# EAGLE design placa 3 cm (EAGLE 8.0.1)
COMPANY: Unexpected Maker; DATE: 24-10-2018; DRAWN: Seon; REV: V1; TITLE: TinyPICO

## Sheet 1 of 2
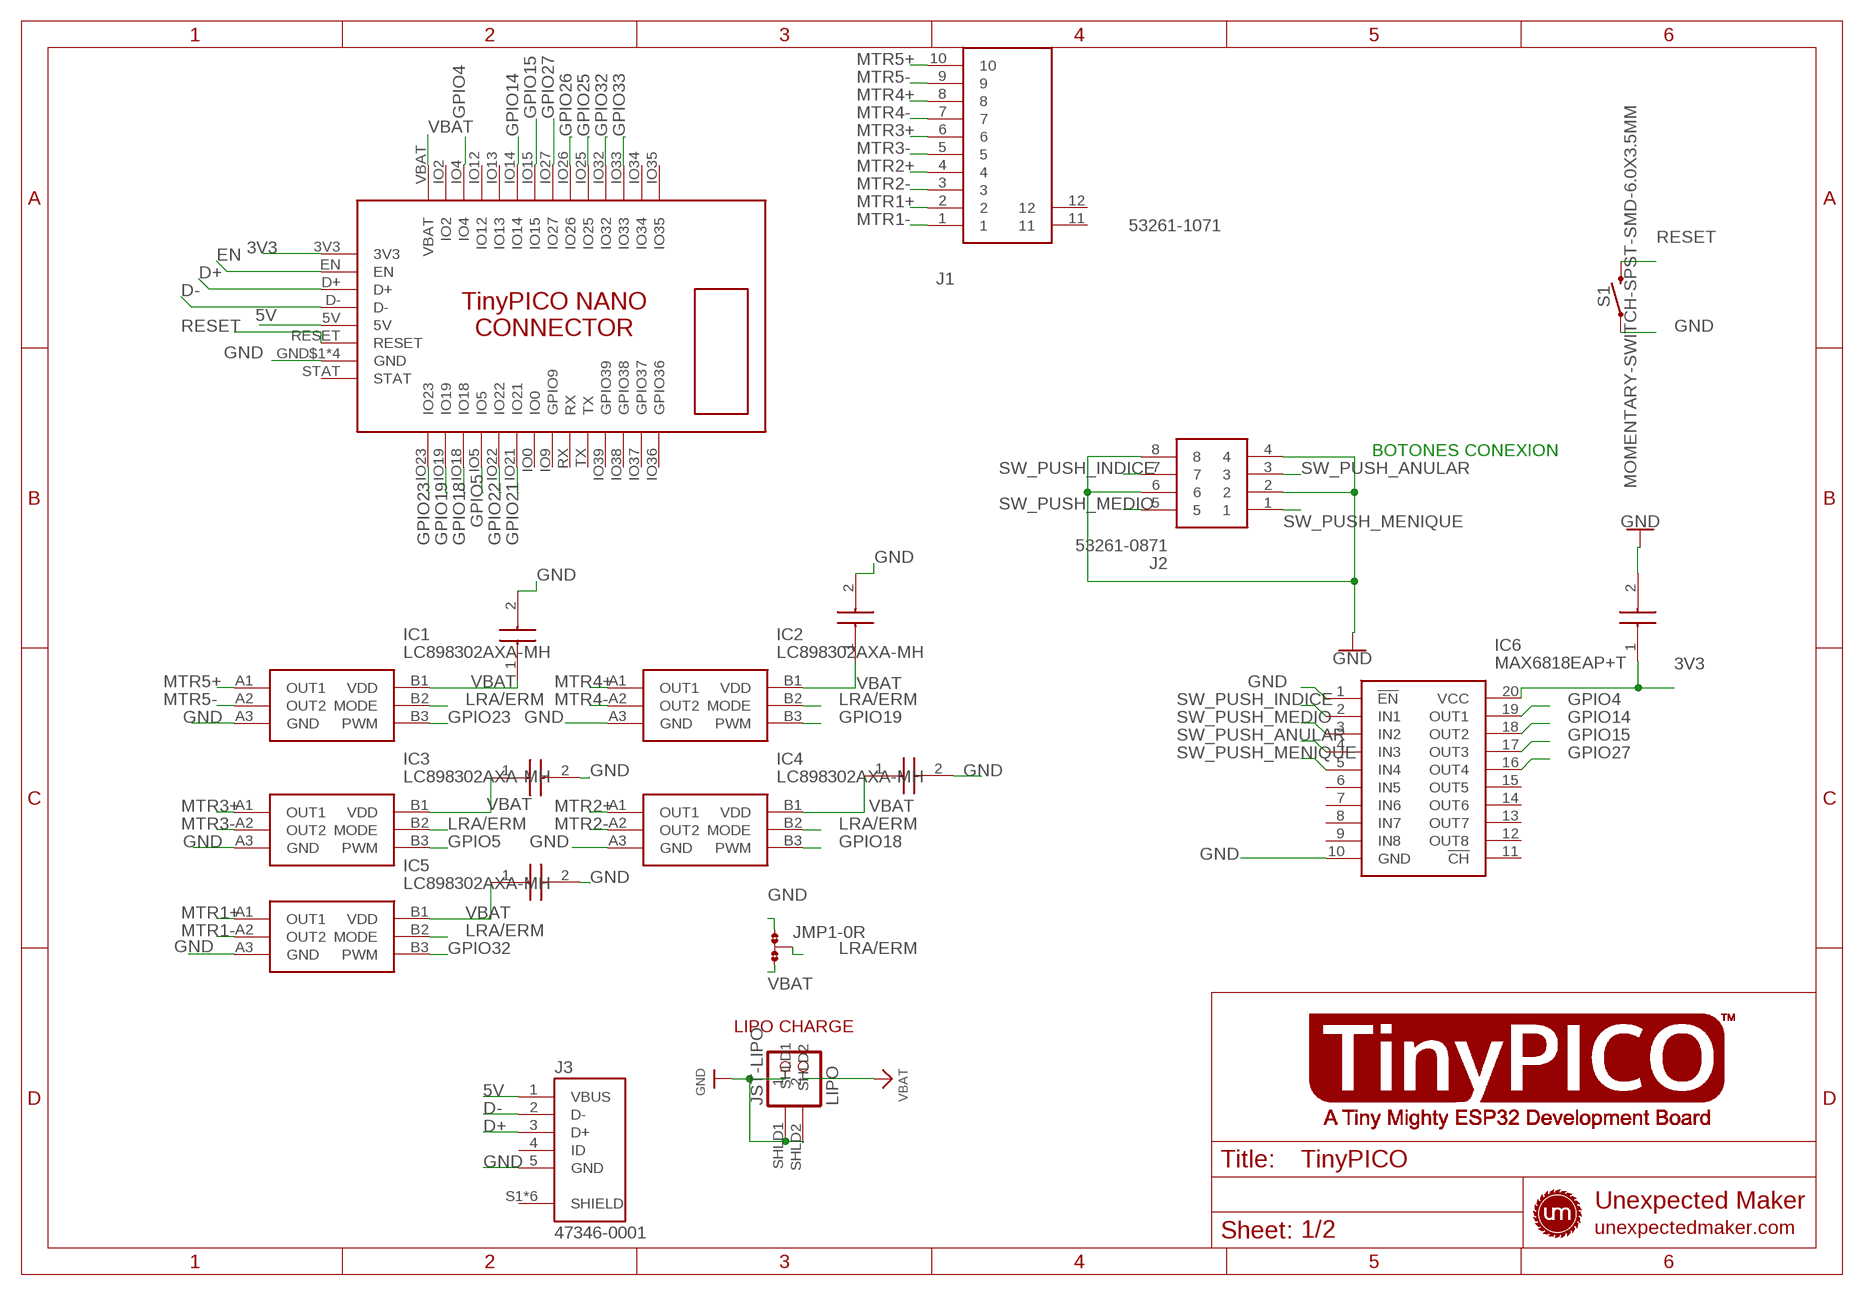
[diagram p0: schematic, sheet 1]

### Parts
C1  0603B104K160CT  [CAPC1608X87N]
C2  0603B104K160CT  [CAPC1608X87N]
C3  0603B104K160CT  [CAPC1608X87N]
C4  0603B104K160CT  [CAPC1608X87N]
C5  0603B104K160CT  [CAPC1608X87N]
C8  0603B104K160CT  [CAPC1608X87N]
IC1  LC898302AXA-MH  [BGA6C40P3X2_118X78X65]
IC2  LC898302AXA-MH  [BGA6C40P3X2_118X78X65]
IC3  LC898302AXA-MH  [BGA6C40P3X2_118X78X65]
IC4  LC898302AXA-MH  [BGA6C40P3X2_118X78X65]
IC5  LC898302AXA-MH  [BGA6C40P3X2_118X78X65]
IC6  MAX6818EAP+T  [SOP65P778X199-20N]
J1  53261-1071  [532611071]
J2  53261-0871  [53261-0871]
J3  47346-0001  [MOLEX_47346-0001]
JMP1  0R-JUMPA  [A0R-JMP]
JST-LIPO  LIPO  JST_2PIN  [JSTPH2]
S1  MOMENTARY-SWITCH-SPST-SMD-6.0X3.5MM  [TACTILE_SWITCH_SMD_6.0X3.5MM]
U$1  TINYPICO-NANO-CONNECTOR  [TINYPICO-NANO-CONNECTOR]

### Nets
3V3: C8.1 IC6.20(VCC) U$1.3V3
5V: J3.1(VBUS) U$1.5V
D+: J3.3(D+) U$1.D+
D-: J3.2(D-) U$1.D-
EN: U$1.EN
GND: C1.2 C2.2 C3.2 C4.2 C5.2 C8.2 IC1.A3(GND) IC2.A3(GND) IC3.A3(GND) IC4.A3(GND) IC5.A3(GND) IC6.1(!EN) IC6.10(GND) J2.2 J2.4 J2.6 J2.8 J3.5(GND) JMP1.1 JST-LIPO.1 JST-LIPO.SHLD1 JST-LIPO.SHLD2 S1.1 U$1.GND$1(GND) U$1.GND$2(GND) U$1.GND$3(GND) U$1.GND$4(GND)
GPIO4: IC6.19(OUT1) U$1.IO4
GPIO5: IC3.B3(PWM) U$1.IO5
GPIO14: IC6.18(OUT2) U$1.IO14
GPIO15: IC6.17(OUT3) U$1.IO15
GPIO18: IC4.B3(PWM) U$1.IO18
GPIO19: IC2.B3(PWM) U$1.IO19
GPIO21: U$1.IO21
GPIO22: U$1.IO22
GPIO23: IC1.B3(PWM) U$1.IO23
GPIO25: U$1.IO25
GPIO26: U$1.IO26
GPIO27: IC6.16(OUT4) U$1.IO27
GPIO32: IC5.B3(PWM) U$1.IO32
GPIO33: U$1.IO33
LRA/ERM: IC1.B2(MODE) IC2.B2(MODE) IC3.B2(MODE) IC4.B2(MODE) IC5.B2(MODE) JMP1.2
MTR1+: IC5.A1(OUT1) J1.2
MTR1-: IC5.A2(OUT2) J1.1
MTR2+: IC4.A1(OUT1) J1.4
MTR2-: IC4.A2(OUT2) J1.3
MTR3+: IC3.A1(OUT1) J1.6
MTR3-: IC3.A2(OUT2) J1.5
MTR4+: IC2.A1(OUT1) J1.8
MTR4-: IC2.A2(OUT2) J1.7
MTR5+: IC1.A1(OUT1) J1.10
MTR5-: IC1.A2(OUT2) J1.9
RESET: S1.2 U$1.RESET
SW_PUSH_ANULAR: IC6.4(IN3) J2.3
SW_PUSH_INDICE: IC6.2(IN1) J2.7
SW_PUSH_MEDIO: IC6.3(IN2) J2.5
SW_PUSH_MENIQUE: IC6.5(IN4) J2.1
VBAT: C1.1 C2.1 C3.1 C4.1 C5.1 IC1.B1(VDD) IC2.B1(VDD) IC3.B1(VDD) IC4.B1(VDD) IC5.B1(VDD) JMP1.3 JST-LIPO.2 U$1.VBAT
Unconnected: IC6.6(IN5) IC6.7(IN6) IC6.8(IN7) IC6.9(IN8) IC6.11(!CH) IC6.12(OUT8) IC6.13(OUT7) IC6.14(OUT6) IC6.15(OUT5) J1.11 J1.12 J3.4(ID) J3.S1(SHIELD) J3.S2(SHIELD) J3.S3(SHIELD) J3.S4(SHIELD) J3.S5(SHIELD) J3.S6(SHIELD) U$1.IO0 U$1.IO2 U$1.IO9(GPIO9) U$1.IO12 U$1.IO13 U$1.IO34 U$1.IO35 U$1.IO36(GPIO36) U$1.IO37(GPIO37) U$1.IO38(GPIO38) U$1.IO39(GPIO39) U$1.RX U$1.STAT U$1.TX

### Notes on the sheet
- BOTONES CONEXION
- LIPO CHARGE

## Sheet 2 of 2: Botons
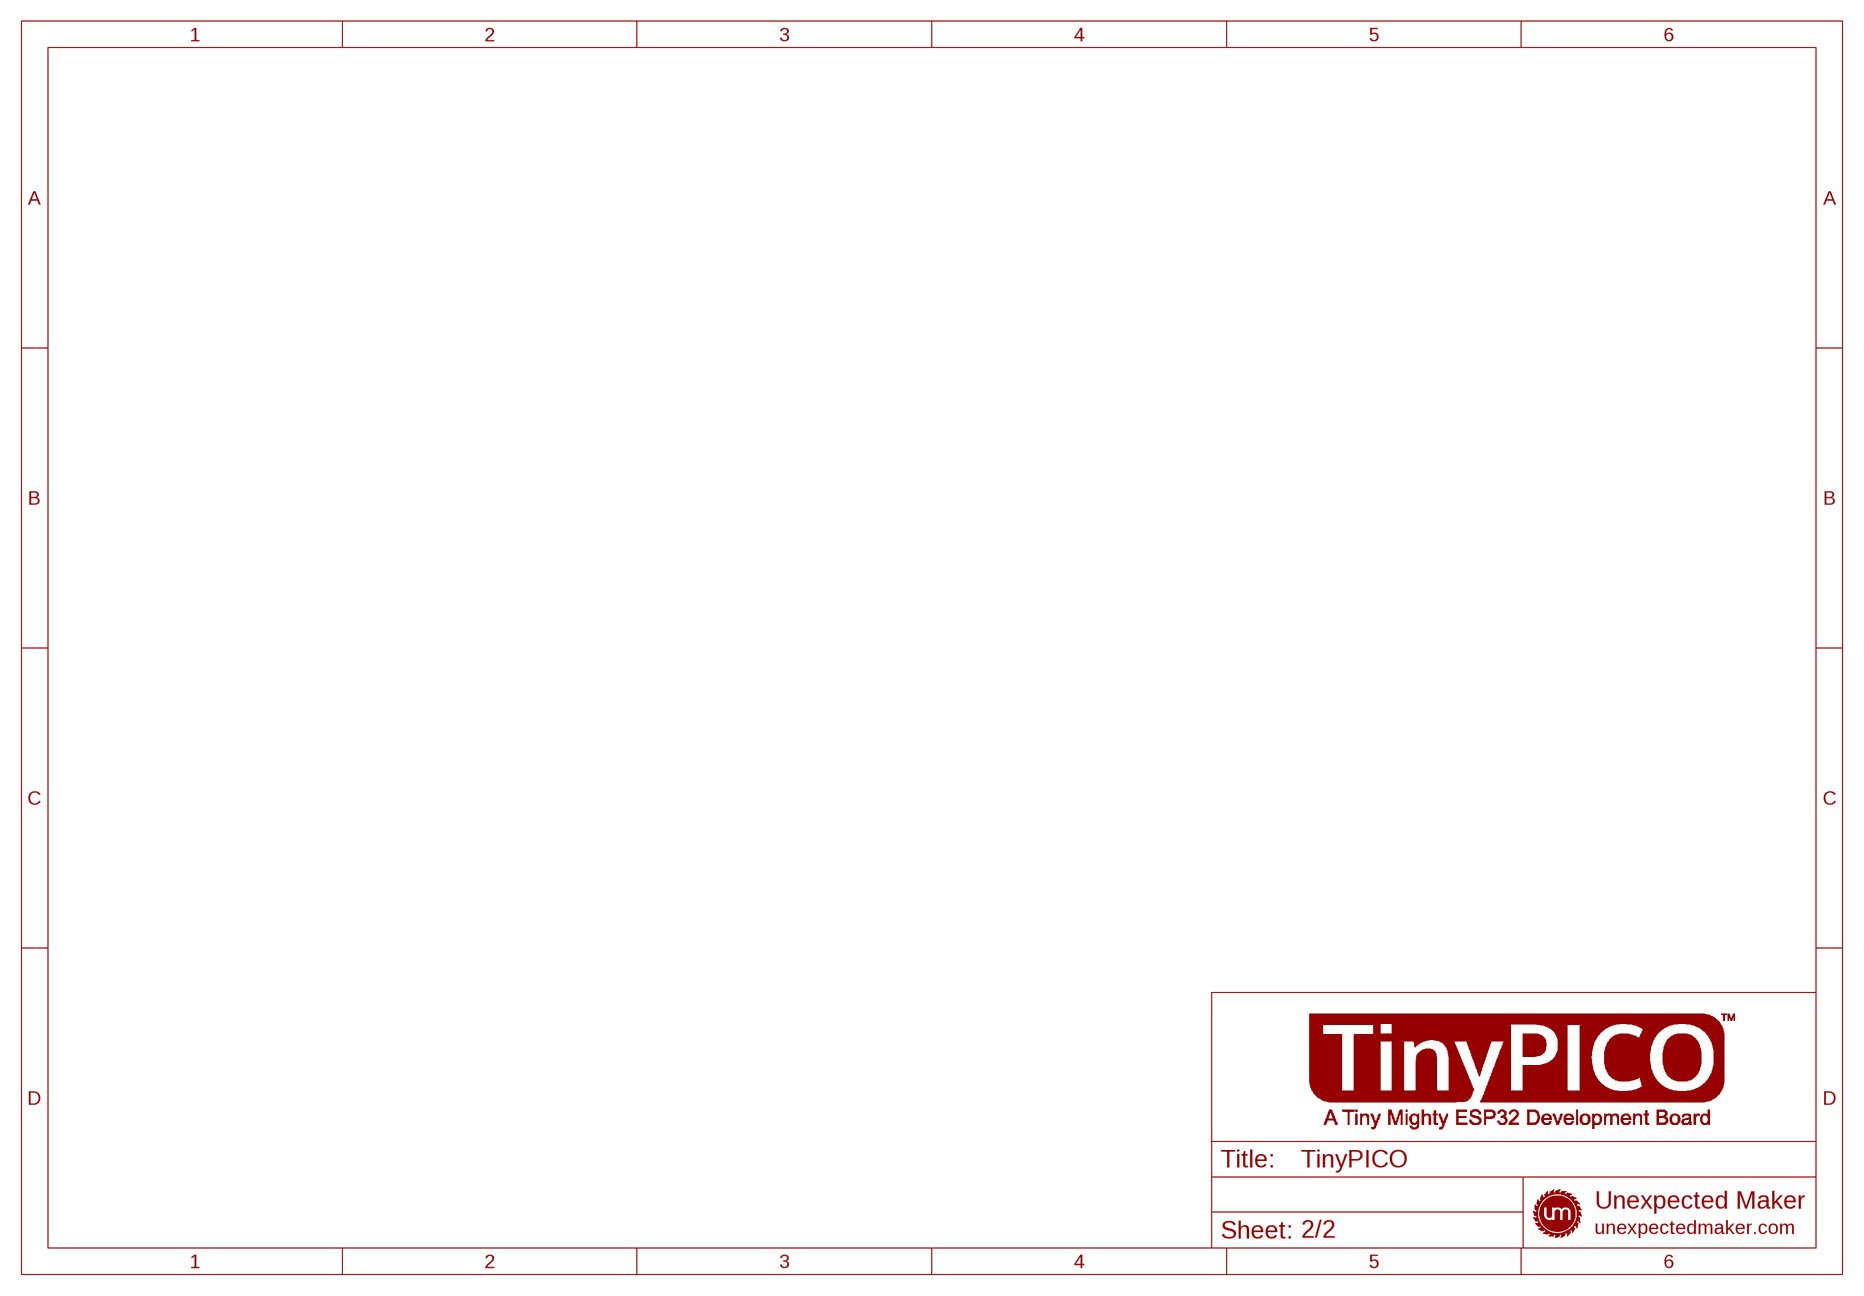
[diagram p1: schematic, sheet 2]

## Library data of the parts
C1-C5 C8 = SamacSys_Parts:0603B104K160CT: WALSIN - 0603B104K160CT - CAP, 0.1F, 16V, 10%, X7R, 0603 Source: Datasheet <https://componentsearchengine.com/Datasheets/1/0603B104K160CT.pdf>; DESCRIPTION: WALSIN - 0603B104K160CT - CAP, 0.1F, 16V, 10%, X7R, 0603; HEIGHT: 0.87mm; MANUFACTURER_NAME: Walsin Technology Corporation; MANUFACTURER_PART_NUMBER: 0603B104K160CT; MOUSER_PART_NUMBER: 791-0603B104K160CT; MOUSER_PRICE-STOCK: https://www.mouser.com/Search/Refine.aspx?Keyword=791-0603B104K160CT
IC1-IC5 = SamacSys_Parts:LC898302AXA-MH: Motor / Motion / Ignition Controllers & Drivers Linear Vibrator Driv Source: Datasheet <https://www.arrow.com/en/products/lc898302axa-mh/on-semiconductor>; DESCRIPTION: Motor / Motion / Ignition Controllers & Drivers Linear Vibrator Driv; HEIGHT: 0.65mm; MANUFACTURER_NAME: ON Semiconductor; MANUFACTURER_PART_NUMBER: LC898302AXA-MH; MOUSER_PART_NUMBER: 863-LC898302AXA-MH; MOUSER_PRICE-STOCK: https://www.mouser.co.uk/ProductDetail/ON-Semiconductor/LC898302AXA-MH?qs=raqtESnDWsCbGq19hBfPlw%3D%3D
IC6 = SamacSys_Parts:MAX6818EAP+T: MAXIM INTEGRATED PRODUCTS - MAX6818EAP+T. - ESD PROTE WITH SWITCH DEBOUNCER, SSOP-20 Source: Datasheet; DESCRIPTION: MAXIM INTEGRATED PRODUCTS - MAX6818EAP+T. - ESD PROTE WITH SWITCH DEBOUNCER, SSOP-20; HEIGHT: 1.99mm; MANUFACTURER_NAME: Maxim Integrated; MANUFACTURER_PART_NUMBER: MAX6818EAP+T; MOUSER_PART_NUMBER: 700-MAX6818EAPT; MOUSER_PRICE-STOCK: https://www.mouser.co.uk/ProductDetail/Maxim-Integrated/MAX6818EAP%2bT?qs=CDqwynd4ZNoKt6d34O8j%252BA%3D%3D
J1 = SamacSys_Parts:53261-1071: 10 way SMT r/a header Molex PICOBLADE Series, Series Number 53261, 1.25mm Pitch 10 Way 1 Row Shrouded Right Angle PCB Header, Surface Mount Source: Datasheet <https://www.molex.com/webdocs/datasheets/pdf/en-us/0532611071_PCB_HEADERS.pdf>; DESCRIPTION: 10 way SMT r/a header Molex PICOBLADE Series, Series Number 53261, 1.25mm Pitch 10 Way 1 Row Shrouded Right Angle PCB Header, Surface Mount; HEIGHT: 3mm; MANUFACTURER_NAME: Molex; MANUFACTURER_PART_NUMBER: 53261-1071; MOUSER_PART_NUMBER: 538-53261-1071; MOUSER_PRICE-STOCK: https://www.mouser.co.uk/ProductDetail/Molex/53261-1071?qs=%252B72YyncTwW%252Bzs3RwZTiukQ%3D%3D
J2 = SamacSys_Parts:53261-0871: Molex PICOBLADE Series, Series Number 53261, 1.25mm Pitch, 8 Way 1 Row Shrouded Right Angle PCB Header, Surface Mount Source: Datasheet <http://www.molex.com/webdocs/datasheets/pdf/en-us/0532610871_PCB_HEADERS.pdf>; DESCRIPTION: Molex PICOBLADE Series, Series Number 53261, 1.25mm Pitch, 8 Way 1 Row Shrouded Right Angle PCB Header, Surface Mount; HEIGHT: mm; MANUFACTURER_NAME: Molex; MANUFACTURER_PART_NUMBER: 53261-0871; MOUSER_PART_NUMBER: 538-53261-0871; MOUSER_PRICE-STOCK: https://www.mouser.co.uk/ProductDetail/Molex/53261-0871?qs=%252B72YyncTwW%252BggfdCJ7Netw%3D%3D
J3 = 47346-0001:47346-0001: USB Connectors MICRO USB B RECPT BTTM MOUNT ASSY Check prices <https://pricing.snapeda.com/parts/47346-0001/Molex/view-part?ref=eda>; AVAILABILITY: Warning; DESCRIPTION: USB Connectors MICRO USB B RECPT BTTM MOUNT ASSY; MF: Molex; MP: 47346-0001; PACKAGE: None; PRICE: None; PURCHASE-URL: https://pricing.snapeda.com/search/part/47346-0001/?ref=eda
JMP1 = jump-0r-smd:0R-JUMP: SMD 0R 0805 Jumper
JST-LIPO = UnexpectedMaker:JST_2PIN: JST 2-Pin Right-Angle Connector PH-Series - 4UConnector: 17311 SH-Series - 4UConnector: 07278
S1 = SparkFun-Switches:MOMENTARY-SWITCH-SPST: Momentary Switch (Pushbutton) - SPST Normally-open (NO) SPST momentary switches (buttons, pushbuttons). Variants PTH-12MM - 12mm square, through-hole Momentary Pushbutton Switch - 12mm Square <https://www.sparkfun.com/products/9190> (COM-09190) PTH-6.0MM, PTH-6.0MM-KIT - 6.0mm square, through-hole Mini Pushbutton Switch <https://www.sparkfun.com/products/97> (COM-00097) KIT package intended for soldering kit's - only one side of pads' copper is exposed. PTH-RIGHT-ANGLE-KIT - Right-angle, through-hole Right Angle Tactile Button <https://www.sparkfun.com/products/10791> - Used on SparkFun BigTime Watch Kit <https://www.sparkfun.com/products/11734> SMD-12MM - 12mm square, surface-mount Tactile Button - SMD (12mm) <https://www.sparkfun.com/products/12993> (COM-12993) Used on SparkFun PicoBoard <https://www.sparkfun.com/products/11888> SMD-4.5MM - 4.5mm Square Trackball Switch Used on SparkFun Blackberry Trackballer Breakout <https://www.sparkfun.com/products/13169> SMD-4.6MMX2.8MM - 4.60mm x 2.80mm, surface mount Used on SparkFun SAMD21 Mini Breakout <https://www.sparkfun.com/products/13664> SMD-5.2MM, SMD-5.2-REDUNDANT - 5.2mm square, surface-mount Mini Pushbutton Switch - SMD <https://www.sparkfun.com/products/8720> (COM-08720) Used on Arduino Pro Mini <https://www.sparkfun.com/products/11114> REDUNDANT package connects both switch circuits together SMD-6.0X3.5MM - 6.0 x 3.5mm, surface mount Momentary Reset Switch SMD <https://www.sparkfun.com/products/8229> (COM-08229) SMD-6.2MM-TALL - 6.2mm square, surface mount Tactile Button - SMD (6mm) <https://www.sparkfun.com/products/12992> Used on SparkFun Digital Sandbox <https://www.sparkfun.com/products/12651> SMD-RIGHT-ANGLE - Right-angle, surface mount Used on SparkFun Block for Intel® Edison - Arduino <https://www.sparkfun.com/products/13036>; PROD_ID: SWCH-00815; SF_SKU: COM-08229
U$1 = TinyPICO_NANO_Eagle:TINYPICO-NANO-CONNECTOR: TinyPICO NANO Footprint https://www.tinypico.com/tinypico-nano

## Board
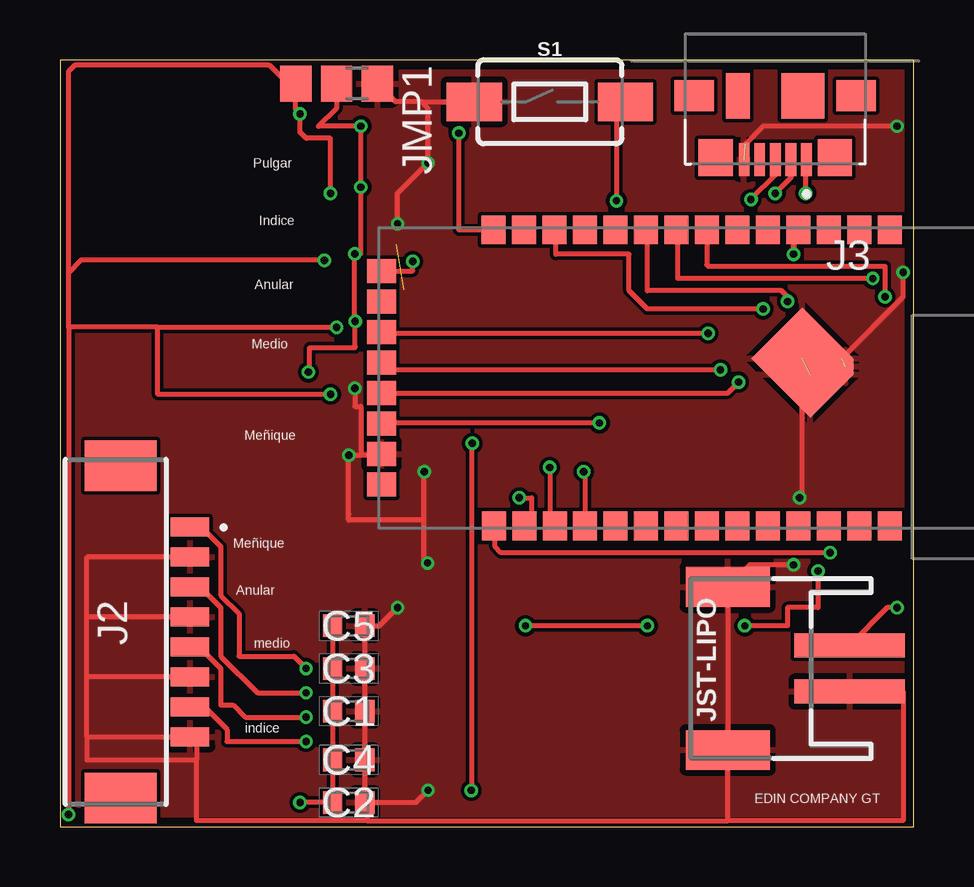
[diagram p2: board, top side]
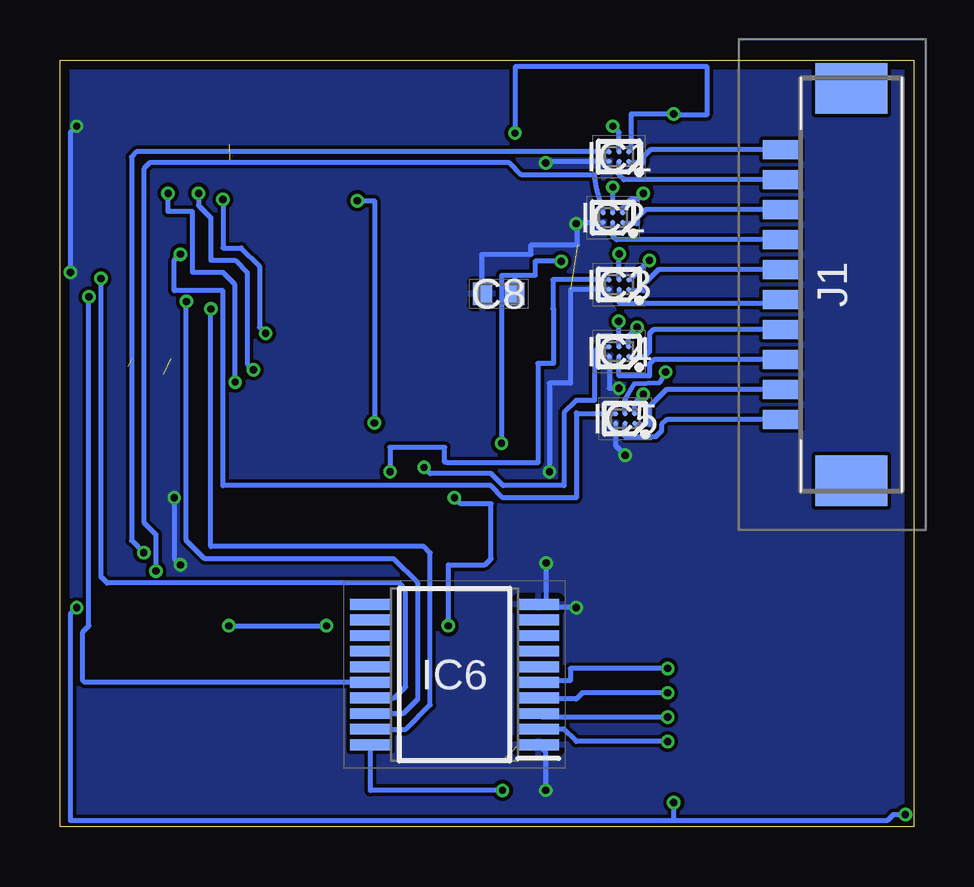
[diagram p3: board, bottom side, seen from below]

Size 35.6 x 31.97 mm. Coordinates in mm from the lower left corner, seen from the top.
Outline: 0,31.97 0,0 35.6,0 35.6,31.97 0,31.97
Copper layers (1*16): Top 0.035559375mm / dielectric 1.6mm / Bottom 0.035559375mm
Design rules "oshpark-2layer": minimum track width 6mil, minimum drill 10mil, track to track 6mil, track to pad 6mil, pad to pad 6mil, via to via 6mil, smd to smd 6mil, copper to edge 15mil, drill to drill 6mil, minimum pad ring 5mil, minimum via ring 5mil, stop-mask expansion 2.5mil, vias tented up to drill 0mil, thermal gap 10mil

### Footprints (pad centres in the part's own frame; a part is rotated, then mirrored left to right if it is on the bottom)
CAPC1608X87N = smd 0.8 x 0.94: 1 -0.67,0; 2 0.67,0
BGA6C40P3X2_118X78X65 = smd 0.2 x 0.2: A1 -0.4,0.2; A2 0,0.2; A3 0.4,0.2; B1 -0.4,-0.2; B2 0,-0.2; B3 0.4,-0.2
SOP65P778X199-20N = smd 1.705 x 0.45: 1 -3.498,2.925; 2 -3.498,2.275; 3 -3.498,1.625; 4 -3.498,0.975; 5 -3.498,0.325; 6 -3.498,-0.325; 7 -3.498,-0.975; 8 -3.498,-1.625; 9 -3.498,-2.275; 10 -3.498,-2.925; 11 3.498,-2.925; 12 3.498,-2.275; 13 3.498,-1.625; 14 3.498,-0.975; 15 3.498,-0.325; 16 3.498,0.325; 17 3.498,0.975; 18 3.498,1.625; 19 3.498,2.275; 20 3.498,2.925
532611071 = smd 0.8 x 1.6: 1 -5.625,2.1; 2 -4.375,2.1; 3 -3.125,2.1; 4 -1.875,2.1; 5 -0.625,2.1; 6 0.625,2.1; 7 1.875,2.1; 8 3.125,2.1; 9 4.375,2.1; 10 5.625,2.1 | smd 2.1 x 3: 11 -8.175,-0.8; 12 8.175,-0.8
53261-0871 = smd 0.8 x 1.6: 1 -4.375,1.004; 2 -3.125,1.004; 3 -1.875,1.004; 4 -0.625,1.004; 5 0.625,1.004; 6 1.875,1.004; 7 3.125,1.004; 8 4.375,1.004 | smd 2.1 x 3: 9 6.925,-1.896; 10 -6.925,-1.896
MOLEX_47346-0001 = smd 0.45 x 1.38: 1 -1.3,2.66; 2 -0.65,2.66; 3 0,2.66; 4 0.65,2.66; 5 1.3,2.66 | smd 1.425 x 1.55: S1 -2.487,2.575; S2 2.487,2.575 | smd 1.65 x 1.3: S3 -3.375,0; S6 3.375,0 | smd 1.8 x 1.9: S4 -1.15,0 | smd 1 x 1.9: S5 1.55,0
A0R-JMP = smd 1.5 x 1.3: 1 0,1.7; 2 0,0; 3 0,-1.7
JSTPH2 = smd 1 x 4.6: 1 -0.965,-3.607; 2 0.965,-3.607 | smd 1.651 x 3.505: SHLD1 -3.4,1.473; SHLD2 3.4,1.473
TACTILE_SWITCH_SMD_6.0X3.5MM = smd 2.3 x 1.6: 1 -3.15,0; 2 3.15,0
TINYPICO-NANO-CONNECTOR = smd 1.2 x 1: 3V3 0.1,10.725; 5V 0.1,5.645; D+ 0.1,8.185; D- 0.1,6.915; EN 0.1,9.455; GND$1 0.1,3.105; RESET 0.1,4.375; STAT 0.1,1.835 | smd 3 x 3 rotated 45: GND$2 17.643,7.082 | smd 0.66 x 0.671: GND$3 19.436,6.746 | smd 2.54 x 2.54 rotated 45: GND$4 17.971,6.413 | smd 1 x 1.2: IO0 12.395,0.1; IO2 6.034,12.44; IO4 7.304,12.44; IO5 8.585,0.1; IO9 13.665,0.1; IO12 8.574,12.44; IO13 9.844,12.44; IO14 11.114,12.44; IO15 12.384,12.44; IO18 7.315,0.1; IO19 6.045,0.1; IO21 11.125,0.1; IO22 9.855,0.1; IO23 4.775,0.1; IO25 16.194,12.44; IO26 14.924,12.44; IO27 13.654,12.44; IO32 17.464,12.44; IO33 18.734,12.44; IO34 20.004,12.44; IO35 21.274,12.44; IO36 21.285,0.1; IO37 20.015,0.1; IO38 18.745,0.1; IO39 17.475,0.1; RX 14.935,0.1; TX 16.205,0.1; VBAT 4.764,12.44

### Placement (x,y rotation side)
C1  12.04,4.82 0 top
C2  12.04,1.01 0 top
C3  12.04,6.6 0 top
C4  12.04,2.79 0 top
C5  12.04,8.38 0 top
C8  17.31,22.22 180 bottom
IC1  12.29,27.94 180 bottom
IC2  12.55,25.4 180 bottom
IC3  12.29,22.6 180 bottom
IC4  12.29,19.81 180 bottom
IC5  12.04,17.02 180 bottom
IC6  19.15,6.35 180 bottom
J1  3.4,22.6 90 bottom
J2  4.42,8.13 270 top
J3  29.82,30.48 180 top
JMP1  11.53,30.99 270 top
JST-LIPO  29.31,6.6 90 top
S1  20.42,30.22 0 top
U$1  13.31,12.44 0 top

### Tracks (layer width: path | path; a pad name or v marks a point on that pad's centre or on a via)
3V3  (via drill 0.3)
  Top 0.203: U$1.3V3 14.71,23.17 v14.71,23.58 | v17.19,15.98 17.15,15.98 v17.15,1.52
  Bottom 0.203: v14.71,23.58 15.78,23.58 15.78,23.53 15.79,23.53 15.79,22.98 16.65,22.98 | 16.65,22.98 C8.1 | 16.65,22.98 17.19,22.98 v17.19,15.98 | IC6.20 22.65,1.52 v17.15,1.52
5V  (via drill 0.3)
  Top 0.203: U$1.5V 27.84,18.09 v28.3,18.54 | v31.09,26.41 31.09,27.79 J3.1
  Bottom 0.203: v28.3,18.54 28.3,22.6 28.8,23.11 30.07,23.11 30.07,25.65 31.09,25.65 v31.09,26.41
D+  (via drill 0.3)
  Top 0.203: J3.3 29.82,27.18 v28.8,26.16 | v27.03,20.57 13.47,20.57 U$1.D+
  Bottom 0.203: v28.8,26.16 28.8,24.13 28.04,24.13 27.28,23.37 27.28,20.83 v27.03,20.57
D-  (via drill 0.3)
  Top 0.203: J3.2 30.47,27.06 v29.82,26.41 | v27.53,19.05 13.72,19.05 U$1.D-
  Bottom 0.203: v29.82,26.41 29.82,25.91 29.31,25.4 29.31,23.62 28.3,23.62 27.79,23.11 27.79,19.3 v27.53,19.05
GND  (via drill 0.3)  (4 unrouted)
  Top 0.203: J2.2 1.12,11.25 1.12,8.75 | 5.69,2.79 1.12,2.79 1.12,3.75 | 1.12,6.25 1.12,8.75 | 1.12,3.75 1.12,6.25 | J2.4 1.12,8.75 | J2.6 1.12,6.25 | 1.12,3.75 J2.8 5.69,3.75 5.69,2.79 | C2.2 12.8,1.01 12.8,0.25 | 12.8,0.25 5.69,0.25 5.69,2.79 | C2.2 C4.2 C1.2 C3.2 C5.2 13.31,8.38 v14.07,9.14 | 27.84,0.25 JST-LIPO.SHLD1 JST-LIPO.SHLD2 28.76,10.92 v30.58,10.92 | 12.8,0.25 27.84,0.25 | JST-LIPO.1 35.15,5.64 35.15,0.25 27.84,0.25 | C2.2 14.83,1.01 v15.34,1.52 | v30.84,13.71 30.95,13.83 U$1.GND$2 32.58,19.53 35.15,22.1 v35.15,23.11 | v34.9,29.21 29.31,29.21 28.55,28.45 | 15.09,30.22 S1.1 | 15.09,30.22 13.99,30.22 JMP1.1 | 15.09,30.22 15.34,29.97 v15.34,27.68 14.07,26.41 v14.07,25.14 | 12.55,15.49 v12.04,15.49 12.04,13.02 12.04,12.79 15.17,12.79 | 12.55,15.49 13.35,15.49 U$1.GND$1 | v12.29,18.29 12.29,17.52 12.55,17.52 12.55,15.49 | v15.19,14.8 15.17,14.8 15.17,12.79 | v15.32,11 15.17,11 15.17,12.79
  Bottom 0.203: v15.34,1.52 15.34,3.11 IC6.1 | v30.84,13.71 30.84,11.17 v30.58,10.92 | v35.15,23.11 35.15,28.95 v34.9,29.21 | v14.07,9.14 15.52,9.14 IC6.10 15.32,9.27 v15.32,11 | IC1.A3 15.29,27.74 v15.34,27.68 | 14.02,25.2 IC2.A3 | 14.02,25.2 v14.07,25.14 | IC5.A3 12.44,15.89 v12.04,15.49 | IC4.A3 12.69,18.29 v12.29,18.29 | IC3.A3 14.32,22.4 14.32,18.5 15.19,18.5 v15.19,14.8 | C8.2 18.01,23.08 18.01,23.87 15.96,23.87 15.96,24.26 14.02,24.26 14.02,25.2
  pour Bottom: 35.53,33.35 35.53,-3.7 -1.02,-3.68 -1.02,33.37
  pour Top: -1.17,33.53 -1.17,-4.57 35.57,-4.76 35.57,33.34
GPIO4  (via drill 0.3)
  Top 0.203: v29.31,21.59 24.49,21.59 23.72,22.35 23.72,23.87 20.68,23.87 20.68,24.82 U$1.IO4
  Bottom 0.203: IC6.19 21.17,4.07 20.17,5.08 20.17,11.43 20.42,11.68 29.31,11.68 v29.31,21.59
GPIO5  (via drill 0.3)
  Top 0.203: v21.84,14.81 21.89,14.81 U$1.IO5
  Bottom 0.203: IC3.B3 15.05,22.8 15.05,21.59 15.02,21.59 15.02,19.32 15.67,19.32 15.67,15.17 19.45,15.17 19.45,15.2 19.57,15.2 19.57,15.82 21.84,15.82 v21.84,14.81
GPIO14  (via drill 0.3)
  Top 0.203: v30.33,21.9 30.33,22.1 30.07,22.35 24.49,22.35 24.49,24.82 U$1.IO14
  Bottom 0.203: IC6.18 21.29,4.72 20.68,5.33 20.68,10.16 21.69,11.17 29.57,11.17 30.33,11.94 v30.33,21.9
GPIO15  (via drill 0.3)
  Top 0.203: v33.88,22.86 25.76,22.86 25.76,24.82 U$1.IO15
  Bottom 0.203: IC6.17 21.65,5.37 21.18,5.84 21.18,9.9 21.44,10.16 33.63,10.16 33.88,10.41 v33.88,22.86
GPIO18  (via drill 0.3)
  Top 0.203: v20.42,14.98 20.42,12.75 U$1.IO18
  Bottom 0.203: IC4.B3 13.11,20.01 13.31,19.81 13.31,17.78 14.07,17.78 14.58,17.27 14.58,14.22 17.12,14.22 17.63,14.73 20.17,14.73 v20.42,14.98
GPIO19  (via drill 0.3)
  Top 0.203: v31.6,10.67 31.6,9.14 30.33,9.14 30.33,8.38 v28.55,8.38 | v24.49,8.38 v19.41,8.38 | v19.15,13.71 19.66,13.71 19.66,12.85 U$1.IO19
  Bottom 0.203: IC2.B3 13.2,26.56 13.31,27.18 16.36,27.18 16.87,27.68 31.85,27.68 32.11,27.43 32.11,12.7 31.6,12.19 v31.6,10.67 | v28.55,8.38 v24.49,8.38 | v19.41,8.38 19.41,10.92 17.88,10.92 17.63,11.17 17.63,13.46 18.9,13.46 v19.15,13.71
GPIO23  (via drill 0.3)
  Top 0.203: v32.11,11.43 18.39,11.43 18.14,11.68 18.14,12.49 U$1.IO23
  Bottom 0.203: IC1.B3 32.41,28.14 32.61,27.94 32.61,11.94 v32.11,11.43
GPIO27  (via drill 0.3)
  Top 0.203: U$1.IO27 26.96,23.43 27.03,23.37 34.39,23.37 v34.39,22.1
  Bottom 0.203: IC6.16 34.58,6.02 34.65,6.09 34.65,8.13 34.39,8.38 v34.39,22.1
GPIO32  (via drill 0.3)
  Top 0.254: U$1.IO32 30.58,24.88 v30.58,23.87
  Bottom 0.203: IC5.B3 14.02,17.22 14.07,17.27 14.07,13.71 17.12,13.71 17.63,14.22 28.8,14.22 28.8,22.35 30.84,22.35 30.84,23.62 v30.58,23.87
LRA/ERM  (via drill 0.3)
  Top 0.203: JMP1.2 11.53,29.97 10.77,29.21 v12.55,29.21 v12.55,26.67 12.55,23.88 v12.29,23.88 12.29,21.08 v12.3,21.08 IC4.B2 12.29,19.97 10.41,19.97 10.41,18.96 v10.35,18.96
  Bottom 0.203: IC1.B2 12.29,28.95 v12.55,29.21 | IC2.B2 v12.55,26.67 | IC5.B2 12.04,17.82 | 12.04,17.82 12.02,17.82 | 12.04,17.82 11.66,18.48 10.6,18.52 v10.35,18.96 | IC3.B2 v12.29,23.88 | IC4.B2 v12.3,21.08
MTR1+
  Bottom 0.203: J1.2 10.32,18.23 11.02,17.52 11.02,16.76 11.59,16.76 IC5.A1
MTR1-
  Bottom 0.203: J1.1 10.3,16.98 10.52,16.76 10.52,16.51 10.77,16.25 12.04,16.25 IC5.A2
MTR2+
  Bottom 0.203: J1.4 10.87,20.73 11.02,20.57 11.02,19.81 11.28,19.56 11.84,19.56 IC4.A1
MTR2-
  Bottom 0.203: J1.3 10.85,19.48 11.02,19.3 11.02,18.79 12.29,18.79 IC4.A2
MTR3+
  Bottom 0.203: J1.6 10.65,23.23 11.28,22.6 11.28,22.35 11.84,22.35 IC3.A1
MTR3-
  Bottom 0.203: IC3.A2 12.29,21.84 5.64,21.84 J1.5
MTR4+
  Bottom 0.203: J1.8 11.2,25.73 11.53,25.4 11.53,25.14 12.09,25.14 IC2.A1
MTR4-
  Bottom 0.203: J1.7 12.39,24.48 12.55,24.64 IC2.A2
MTR5+
  Bottom 0.203: J1.10 10.99,28.23 11.28,27.94 11.28,27.68 11.84,27.68 IC1.A1
MTR5-
  Bottom 0.203: J1.9 12.1,26.98 12.29,27.18 IC1.A2
RESET  (via drill 0.3)
  Top 0.203: S1.2 23.2,30.22 v23.2,26.1 | v22.49,16.84 13.41,16.84 U$1.RESET
  Bottom 0.203: v23.2,26.1 22.49,26.1 v22.49,16.84
SW_PUSH_ANULAR  (via drill 0.3)
  Top 0.203: J2.3 5.85,10 6.71,9.14 6.71,7.11 8.23,5.59 v10.26,5.59
  Bottom 0.203: v10.26,5.59 13.82,5.59 14.07,5.33 15.61,5.33 IC6.4
SW_PUSH_INDICE  (via drill 0.3)
  Top 0.203: J2.7 6.02,5 6.96,4.06 6.96,3.55 v10.26,3.55
  Bottom 0.203: 14.59,4.07 IC6.2 | 14.59,4.07 14.58,4.06 | v10.26,3.55 14.07,3.55 14.59,4.07
SW_PUSH_MEDIO  (via drill 0.3)
  Top 0.203: J2.5 5.81,7.5 6.71,6.6 6.71,5.08 7.21,5.08 7.72,4.57 v10.26,4.57
  Bottom 0.203: v10.26,4.57 15.5,4.57 IC6.3
SW_PUSH_MENIQUE  (via drill 0.3)
  Top 0.203: J2.1 5.89,12.5 6.71,11.68 6.71,9.65 7.47,8.89 7.47,7.11 9.75,7.11 v10.26,6.6
  Bottom 0.203: v10.26,6.6 14.33,6.6 14.33,6.09 15.58,6.09 IC6.5
VBAT  (via drill 0.3)
  Top 0.203: C5.1 C3.1 C1.1 C4.1 11.37,2.28 C2.1 v10.01,1.01 | v34.9,9.14 34.49,9.14 JST-LIPO.2 | 0.36,23.11 0.36,31.49 0.61,31.75 8.74,31.75 9.5,30.99 JMP1.3 9.83,29.89 v10.01,29.72 10.01,28.95 10.26,28.7 11.28,28.7 v11.28,26.41 | 0.36,20.83 0.36,23.11 | 0.36,20.83 v0.36,0.51 | v11.02,23.62 0.86,23.62 0.36,23.11 | 4.08,20.83 v11.53,20.83 | 4.08,20.83 0.36,20.83 | v11.28,18.03 4.08,18.03 4.08,20.83 | U$1.VBAT 16.63,24.88 v16.63,28.92
  Bottom 0.203: 10.01,0.25 v10.01,1.01 | 10.01,0.25 35.15,0.25 35.15,8.89 v34.9,9.14 | IC1.B1 11.79,28.25 11.79,29.72 v10.01,29.72 10.01,29.67 8.63,29.67 8.63,31.7 16.61,31.7 16.61,28.92 v16.63,28.92 | v0.36,0.51 0.86,0.51 1.12,0.25 10.01,0.25 | IC2.B1 12.15,25.8 11.79,26.16 11.53,26.16 v11.28,26.41 | IC3.B1 11.84,22.8 v11.02,23.62 | IC4.B1 11.89,20.46 v11.53,20.83 | IC5.B1 11.64,17.67 v11.28,18.03

### Text on the board
tNames: Pulgar | Indice | Anular | Medio | Meñique | Meñique | Anular | medio | indice | EDIN COMPANY GT